# Altium schematic sheet Hub_Core.SchDoc: = Title
size 431 x 279 mm; Revision: v1.0; SheetNumber: 4; SheetTotal: 7
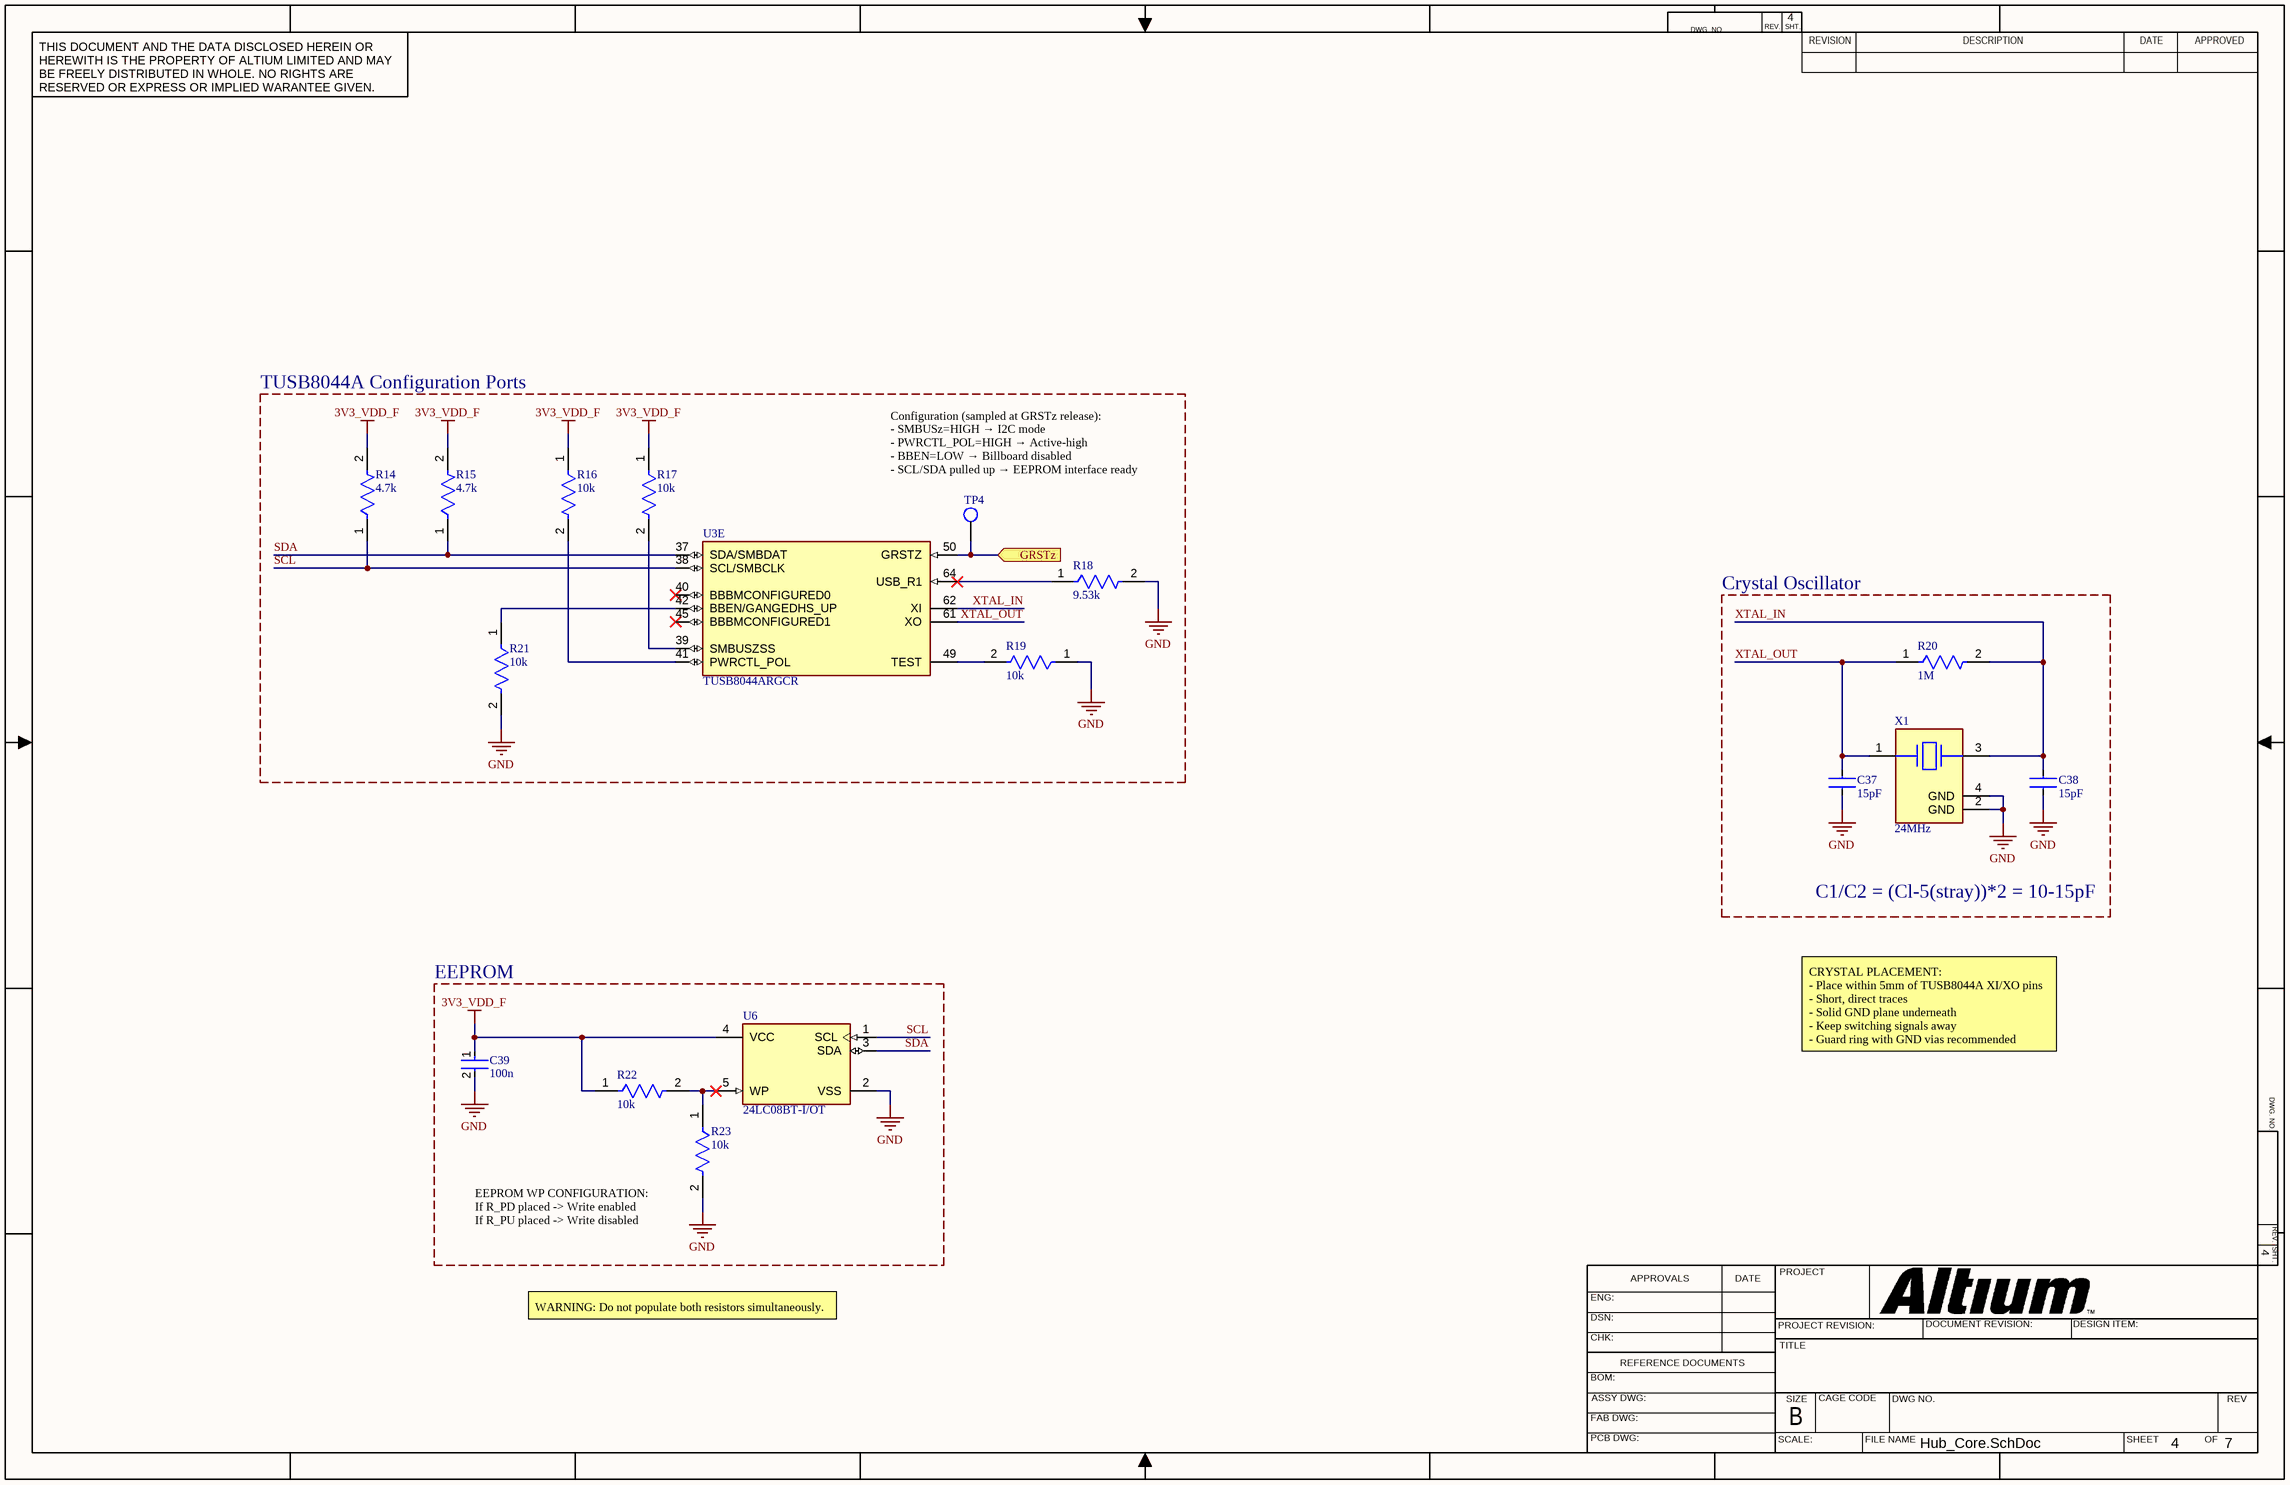
[diagram p0: Hub_Core.SchDoc]

## Parts
C37  15pF  [CAPC1005X56N]
C38  15pF  [CAPC1005X56N]
C39  100n  [FP-GRT155-0_05-IPC_C]
R14  4.7k  [FP-AC0402-MFG]
R15  4.7k  [FP-AC0402-MFG]
R16  10k  [FP-AC0402-MFG]
R17  10k  [FP-AC0402-MFG]
R18  9.53k  [FP-AC0402-IPC_C]
R19  10k  [FP-AC0402-MFG]
R20  1M  [FP-AC0402-IPC_A]
R21  10k  [FP-AC0402-MFG]
R22  10k  [FP-AC0402-MFG]
R23  10k  [FP-AC0402-MFG]
TP4  Test_Point  [Test_Point]  (value not drawn)  (no BOM)
U3  TUSB8044ARGCR  [QFN50P900X900X100-65N-D]  (part E of 6)
U6  24LC08BT-I/OT  [FP-C04-091-OT-MFG]
X1  24MHz  [ABM10N240000MHZ10B1UT3]

## Blocks framed on the sheet
TUSB8044A Configuration Ports: R14-R19 R21 TP4 U3
EEPROM: C39 R22 R23 U6

## Ports
GRSTz (in, see Top_Level[7C], Power[6C])

## Nets
3V3_VDD_F: C39.1 R14.2 R15.2 R16.1 R17.1 R22.1 U6.4(VCC)
GND: C37.1 C38.1 C39.2 R18.2 R19.1 R21.2 R23.2 U6.2(VSS) X1.2(GND) X1.4(GND)
GRSTz: TP4.1 U3.50(GRSTZ) ; port GRSTz
SCL: R14.1 U3.38(SCL/SMBCLK) U6.1(SCL)
SDA: R15.1 U3.37(SDA/SMBDAT) U6.3(SDA)
XTAL_IN: C38.2 R20.2 U3.62(XI) X1.3
XTAL_OUT: C37.2 R20.1 U3.61(XO) X1.1
NetR16_2: R16.2 U3.41(PWRCTL_POL)
NetR17_2: R17.2 U3.39(SMBUSZSS)
NetR18_1: R18.1 U3.64(USB_R1)
NetR19_2: R19.2 U3.49(TEST)
NetR21_1: R21.1 U3.42(BBEN/GANGEDHS_UP)
NetR22_2: R22.2 R23.1 U6.5(WP)

Not connected (* = marked no-connect by the designer): U3 40(BBBMCONFIGURED0)* 45(BBBMCONFIGURED1)*

## Notes on the sheet
- (near TP4) Configuration (sampled at GRSTz release):
  - SMBUSz=HIGH → I2C mode
  - PWRCTL_POL=HIGH → Active-high
  - BBEN=LOW → Billboard disabled
  - SCL/SDA pulled up → EEPROM interface ready
- Crystal Oscillator
- C1/C2 = (Cl-5(stray))*2 = 10-15pF
- CRYSTAL PLACEMENT:
  - Place within 5mm of TUSB8044A XI/XO pins
  - Short, direct traces
  - Solid GND plane underneath
  - Keep switching signals away
  - Guard ring with GND vias recommended
- EEPROM WP CONFIGURATION:
  If R_PD placed -> Write enabled
  If R_PU placed -> Write disabled
- WARNING: Do not populate both resistors simultaneously.
- DWG. NO.
- REV.
- SHT.
- THIS DOCUMENT AND THE DATA DISCLOSED HEREIN OR HEREWITH IS THE PROPERTY OF ALTIUM LIMITED AND MAY BE FREELY DISTRIBUTED IN WHOLE. NO RIGHTS ARE RESERVED OR EXPRESS OR IMPLIED WARANTEE GIVEN.
- REVISION
- DESCRIPTION
- DATE
- APPROVED
- ENG:
- APPROVALS
- PROJECT
- DSN:
- CHK:
- REFERENCE DOCUMENTS
- PROJECT REVISION:
- TITLE
- DOCUMENT REVISION:
- DESIGN ITEM:
- BOM:
- FAB DWG:
- PCB DWG:
- ASSY DWG:
- SCALE:
- SIZE
- B
- CAGE CODE
- FILE NAME
- DWG NO.
- SHEET
- OF
- REV

## Library data of the parts
C37 C38 = 04025U150FAT2A: AVX - 04025U150FAT2A - CAP, MLCC, C0G / NP0, 15PF, 50V, 0402; Manufacturer_Name: Kyocera AVX; Geometry.Height: 0.56mm; Mouser Part Number: 581-04025U150FAT2A; Mouser Price/Stock: https://www.mouser.com/Search/Refine.aspx?Keyword=581-04025U150FAT2A; Manufacturer_Part_Number: 04025U150FAT2A; Datasheet Link: https://componentsearchengine.com/Datasheets/1/04025U150FAT2A.pdf
C39 = CMP-06035-030480-1: Multi-Layer Ceramic Capacitor 100nF 50V X7R ±10% 0402 Paper T/R
R14 R15 = CMP-03412-009386-2: RES 4.7kΩ ±1% 0.063W 0402
R16 R17 R19 R21-R23 = CMP-2002-01790-3: RES 10kΩ ±1% 0.063W 0402; Power Rating: 62.5mW; Voltage Rating: 50V; Temperature Coefficient: 100ppm/°C; Resistance: 10kR; Max Power Dissipation: 63mW; Tolerance: 1%; Military Standard: Not; Construction: Rectangular; Termination: SMD/SMT; Max Operating Temperature: 155°C; Min Operating Temperature: -55°C; Height: 0.015inch; Lead Free: Lead Free; Width: 0.02inch; Case/Package: 0402; Resistor Type: Thick Film; Series: AC; Features: Moisture Resistant; RoHS Compliant: Yes; Number of Terminations: 2; Case Code (Metric): 1005; Length: 0.039inch; Depth: 0.5mm; Size Code: 0402; Packaging: Tape and Reel; Case Code (Imperial): 0402
R18 = CMP-03412-035186-2: RES 9.53kΩ ±1% 0.063W 0402; Temperature Coefficient: 100ppm/°C; Max Power Dissipation: 63mW; Resistance: 9.53kR; Number of Terminations: 2; Case/Package: 0402; Width: 0.02inch; Length: 0.039inch; Min Operating Temperature: -55°C; RoHS Compliant: Yes; Max Operating Temperature: 155°C; Series: AC; Resistor Type: Thick Film; Height: 0.015inch; Tolerance: 1%; Features: Moisture Resistant; Packaging: Tape and Reel
R20 = CMP-2002-01800-2: RES 1MΩ ±1% 0.063W 0402; Power Rating: 62.5mW; Max Power Dissipation: 63mW; Temperature Coefficient: 100ppm/°C; Resistance: 1MR; Voltage Rating: 50V; Packaging: Tape and Reel; Lead Free: Lead Free; Depth: 0.5mm; Series: AC; Length: 0.039inch; Resistor Type: Thick Film; Termination: SMD/SMT; Military Standard: Not; Case/Package: 0402; Min Operating Temperature: -55°C; Tolerance: 1%; Features: Moisture Resistant; Size Code: 0402; Case Code (Imperial): 0402; Number of Terminations: 2; Width: 0.5mm; Construction: Rectangular; Height: 0.015inch; RoHS Compliant: Yes; Case Code (Metric): 1005; Max Operating Temperature: 155°C
U3 = TUSB8044ARGCR: Four-port USB 3.2 x1 Gen1 hub with USB billboard; Manufacturer_Name: Texas Instruments; Geometry.Height: 1mm; Mouser Part Number: 595-TUSB8044ARGCR; Mouser Price/Stock: https://www.mouser.co.uk/ProductDetail/Texas-Instruments/TUSB8044ARGCR?qs=9r4v7xj2LnlTBCFutY1Bfg%3D%3D; Manufacturer_Part_Number: TUSB8044ARGCR; Datasheet Link: http://www.ti.com/lit/gpn/TUSB8044A
U6 = CMP-0159-00589-2: IC EEPROM 8K I2C 400KHZ SOT23-5; Manufacturer: Microchip; Automotive Grade: Grade 3; Import Ts: 1521846298; Interface: I2C,2-Wire; Memory Size: 8Kbits; Access Time: 900ns; Min Supply Voltage: 2.5V; Nominal Supply Current: 1-3mA; Ciiva Ids: 971476; Max Supply Voltage: 5.5V; ComponentLink2Description: Datasheet; Category: IC; Frequency: 400kHz; Digikey Description: IC EEPROM 8K I2C 400KHZ SOT23-5; Ambient Temperature Range High: +85°C; RoHS: TRUE; Ambient Temperature Range Low: -40°C; Temperature Range High: +85°C; Device Class L3: EEPROM; Device Class L2: Memory; Memory Type: EEPROM; Temperature: -40°C to +85°C; Ipc Land Pattern Name: SOT95P280X118-5; Release Date: 1302228452; Manufacturer Part Number: 24LC08BT-I/OT; Automotive: Yes; Mouser Description: EEPROM 1kx8 - 2.5V; Lead Free: Yes; Height: 1.45mm; Octopart: https://octopart.com/24lc08bt-i%2Fot-microchip-93286; Device Class L1: Integrated Circuits (ICs); Package: C04-091-OT; ComponentLink2URL: http://ww1.microchip.com/downloads/en/DeviceDoc/20001710L.pdf; Temperature Range Low: -40°C
X1 = ABM10N-24.0000MHZ-10-B1U-T3: 24 MHz +/-10ppm Crystal 10pF 50 Ohms 4-SMD, No Lead , -20C ~ 70C; Manufacturer_Name: ABRACON; Geometry.Height: 0.65mm; Mouser Part Number: *; Mouser Price/Stock: *; Manufacturer_Part_Number: ABM10N-24.0000MHZ-10-B1U-T3; Datasheet Link: https://abracon.com/datasheets/ABM10N.pdf